# Altium project ECU.PrjPcb
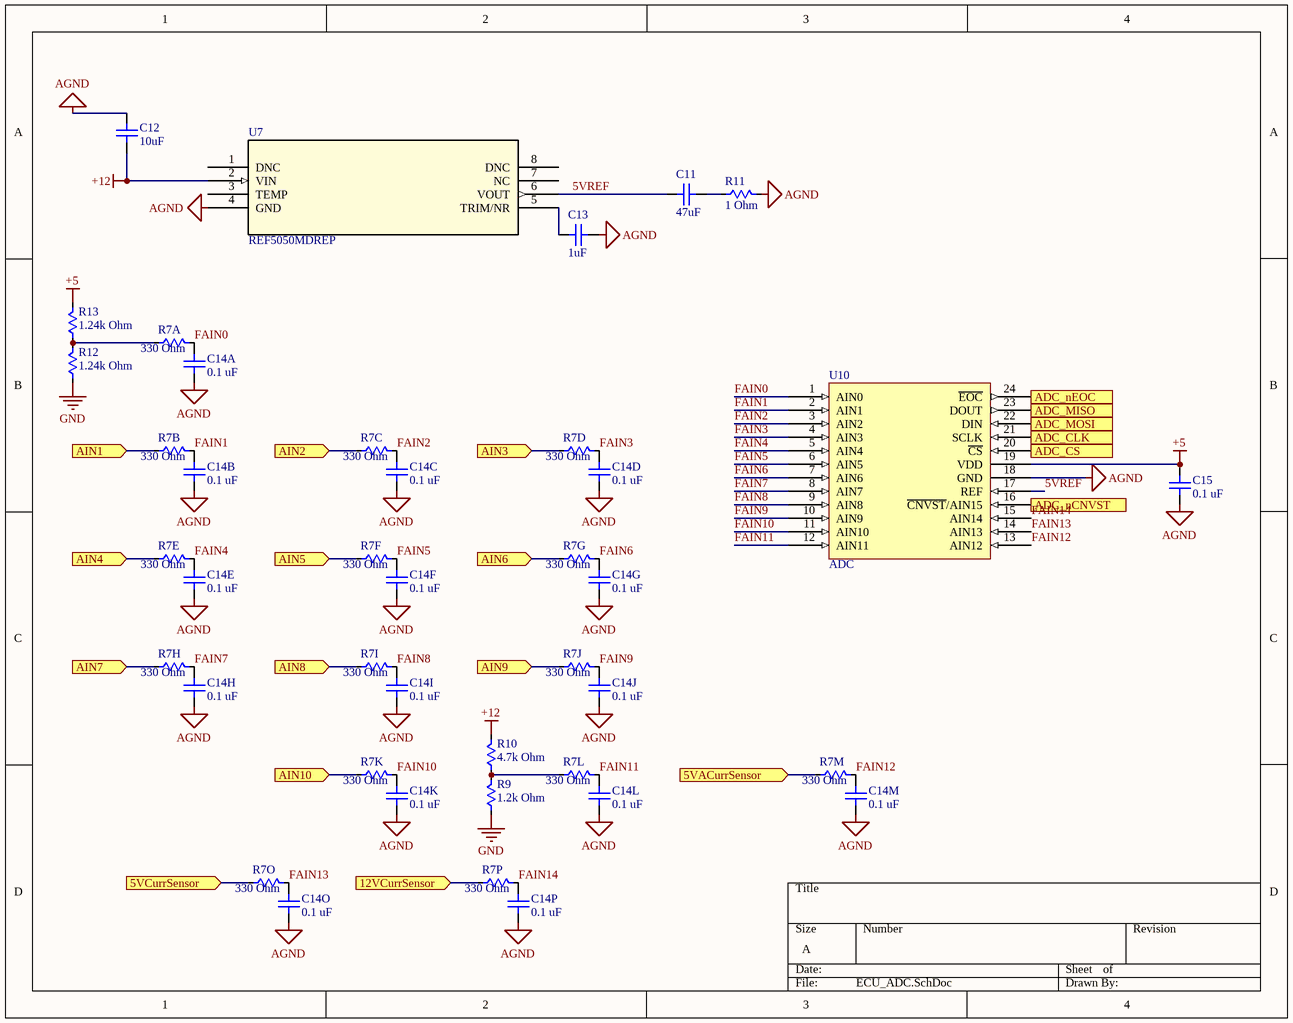
[diagram p0: ECU_ADC.SchDoc]
3 sheets, 79 parts. Net scope: flat (ports and power ports of the same name join across sheets).
Board file: ECU.PcbDoc
Sheets:
  ECU_ADC.SchDoc
  ECU_Interface.SchDoc
  ECU_Power.SchDoc

## Sheet ECU_ADC.SchDoc
size A; SheetNumber: 1; SheetTotal: 3

### Parts
C11  47uF  [0805]
C12  10uF  [0805]
C13  1uF  [0805]
C14A  0.1 uF  [0805]
C14B  0.1 uF  [0805]
C14C  0.1 uF  [0805]
C14D  0.1 uF  [0805]
C14E  0.1 uF  [0805]
C14F  0.1 uF  [0805]
C14G  0.1 uF  [0805]
C14H  0.1 uF  [0805]
C14I  0.1 uF  [0805]
C14J  0.1 uF  [0805]
C14K  0.1 uF  [0805]
C14L  0.1 uF  [0805]
C14M  0.1 uF  [0805]
C14O  0.1 uF  [0805]
C14P  0.1 uF  [0805]
C15  0.1 uF  [0805]
R7A  330 Ohm  [0805]
R7B  330 Ohm  [0805]
R7C  330 Ohm  [0805]
R7D  330 Ohm  [0805]
R7E  330 Ohm  [0805]
R7F  330 Ohm  [0805]
R7G  330 Ohm  [0805]
R7H  330 Ohm  [0805]
R7I  330 Ohm  [0805]
R7J  330 Ohm  [0805]
R7K  330 Ohm  [0805]
R7L  330 Ohm  [0805]
R7M  330 Ohm  [0805]
R7O  330 Ohm  [0805]
R7P  330 Ohm  [0805]
R9  1.2k Ohm  [0805]
R10  4.7k Ohm  [0805]
R11  1 Ohm  [0805]
R12  1.24k Ohm  [0805]
R13  1.24k Ohm  [0805]
U7  REF5050MDREP  [D8]
U10  ADC  [QSOP24]

### Ports
5VACurrSensor (in), 5VCurrSensor (in), 12VCurrSensor (in), ADC_CLK (in), ADC_CS (in), ADC_MISO (out), ADC_MOSI (in), ADC_nCNVST (in), ADC_nEOC (out), AIN1 (in), AIN2 (in), AIN3 (in), AIN4 (in), AIN5 (in), AIN6 (in), AIN7 (in), AIN8 (in), AIN9 (in), AIN10 (in)

### Nets
+5: C15.2 R13.2 U10.19(VDD)
+12: C12.2 R10.2 U7.2(VIN)
AGND: C12.1 C13.2 C14A.1 C14B.1 C14C.1 C14D.1 C14E.1 C14F.1 C14G.1 C14H.1 C14I.1 C14J.1 C14K.1 C14L.1 C14M.1 C14O.1 C14P.1 C15.1 R11.2 U7.4(GND) U10.18(GND)
GND: R9.1 R12.1
5VREF: C11.1 U7.6(VOUT) U10.17(REF)
12VCurrSensor: R7P.1 ; port 12VCurrSensor
FAIN0: C14A.2 R7A.2 U10.1(AIN0)
FAIN1: C14B.2 R7B.2 U10.2(AIN1)
FAIN2: C14C.2 R7C.2 U10.3(AIN2)
FAIN3: C14D.2 R7D.2 U10.4(AIN3)
FAIN4: C14E.2 R7E.2 U10.5(AIN4)
FAIN5: C14F.2 R7F.2 U10.6(AIN5)
FAIN6: C14G.2 R7G.2 U10.7(AIN6)
FAIN7: C14H.2 R7H.2 U10.8(AIN7)
FAIN8: C14I.2 R7I.2 U10.9(AIN8)
FAIN9: C14J.2 R7J.2 U10.10(AIN9)
FAIN10: C14K.2 R7K.2 U10.11(AIN10)
FAIN11: C14L.2 R7L.2 U10.12(AIN11)
FAIN12: C14M.2 R7M.2 U10.13(AIN12)
FAIN13: C14O.2 R7O.2 U10.14(AIN13)
FAIN14: C14P.2 R7P.2 U10.15(AIN14)
NetC11_2: C11.2 R11.1
NetC13_1: C13.1 U7.5(TRIM/NR)
NetJ1_1: R7K.1 ; port AIN10
NetJ1_2: R7B.1 ; port AIN1
NetJ1_3: R7C.1 ; port AIN2
NetJ1_4: R7D.1 ; port AIN3
NetJ1_5: R7E.1 ; port AIN4
NetJ1_6: R7F.1 ; port AIN5
NetJ1_7: R7G.1 ; port AIN6
NetJ1_8: R7H.1 ; port AIN7
NetJ1_9: R7I.1 ; port AIN8
NetJ1_10: R7J.1 ; port AIN9
NetJ4_0-ADC_SS: U10.20(~{CS}) ; port ADC_CS
NetJ4_1-ADC_MISO: U10.23(DOUT) ; port ADC_MISO
NetJ4_15: U10.16(~{CNVST}/AIN15) ; port ADC_nCNVST
NetJ4_16: U10.24(~{EOC}) ; port ADC_nEOC
NetJ4_26-ADC_MOSI: U10.22(DIN) ; port ADC_MOSI
NetJ4_27-ADC_CLK: U10.21(SCLK) ; port ADC_CLK
NetR7A_1: R7A.1 R12.2 R13.1
NetR7L_1: R7L.1 R9.2 R10.1
NetR7M_1: R7M.1 ; port 5VACurrSensor
NetR7O_1: R7O.1 ; port 5VCurrSensor

Not connected (* = marked no-connect by the designer): U7 1(DNC) 3(TEMP) 7(NC) 8(DNC)

### Library data of the parts
C11 = Cap_0805: Samsung Microelectronics CL21A476MQYNNNE
C12 C14A C14B C14C C14D C14E C14F C14G C14H C14I C14J C14K C14L C14M C14O C14P C15 = Cap_0805: Cap 0805
C13 = Cap_0805: 1uF Cap
R7A R7B R7C R7D R7E R7F R7G R7H R7I R7J R7K R7L R7M R7O R7P R9-R13 = Res_0805: Res 0805
U7 = REF5050MDREP: No Description Available; Mfr_Name: Texas Instruments; Copyright: Copyright (C) 2022 Ultra Librarian. All rights reserved.; Manufacturer_Part_Number: REF5050MDREP; RefDes: RefDes; Type: DEV
U10 = MAX11624EEG+-ND: GLOVE, POLYAMIDE, L/FREE, PU, SIZE 6 - More Details

## Sheet ECU_Interface.SchDoc
size A; SheetNumber: 2; SheetTotal: 3
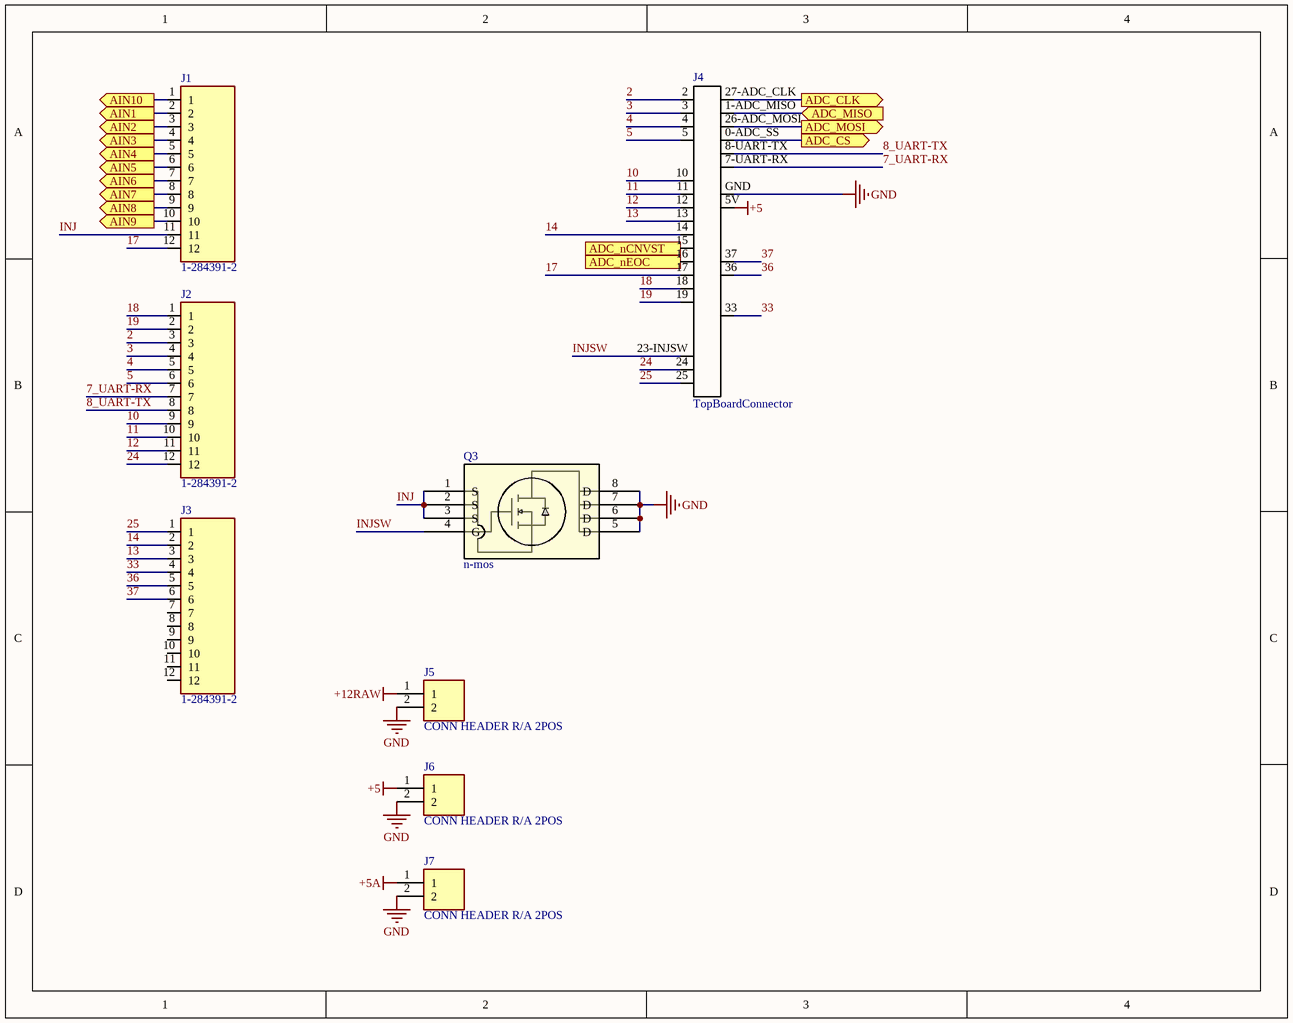
[diagram p1: ECU_Interface.SchDoc]

### Parts
J1  1-284391-2  [TE_1-284391-2]
J2  1-284391-2  [TE_1-284391-2]
J3  1-284391-2  [TE_1-284391-2]
J4  TopBoardConnector  [TopBoardConnector]
J5  CONN HEADER R/A 2POS  [2 POS MOLEX]
J6  CONN HEADER R/A 2POS  [2 POS MOLEX]
J7  CONN HEADER R/A 2POS  [2 POS MOLEX]
Q3  n-mos  [D0008A-IPC_A]

### Ports
ADC_CLK (out), ADC_CS (out), ADC_MISO (in), ADC_MOSI (out), ADC_nCNVST (out), ADC_nEOC (in), AIN1 (out), AIN2 (out), AIN3 (out), AIN4 (out), AIN5 (out), AIN6 (out), AIN7 (out), AIN8 (out), AIN9 (out), AIN10 (out)

### Nets
+5: J4.5V J6.1
+5A: J7.1
+12RAW: J5.1
GND: J4.GND J5.2 J6.2 J7.2 Q3.5(D) Q3.6(D) Q3.7(D) Q3.8(D)
2: J2.3 J4.2
3: J2.4 J4.3
4: J2.5 J4.4
5: J2.6 J4.5
7_UART-RX: J2.7 J4.7-UART-RX(8-UART-RX)
8_UART-TX: J2.8 J4.8-UART-TX
10: J2.9 J4.10
11: J2.10 J4.11
12: J2.11 J4.12
13: J3.3 J4.13
14: J3.2 J4.14
17: J1.12 J4.17
18: J2.1 J4.18
19: J2.2 J4.19
24: J2.12 J4.24
25: J3.1 J4.25
33: J3.4 J4.33
36: J3.5 J4.36
37: J3.6 J4.37
INJ: J1.11 Q3.1(S) Q3.2(S) Q3.3(S)
INJSW: J4.23-INJSW Q3.4(G)
NetJ1_1: J1.1 ; port AIN10
NetJ1_2: J1.2 ; port AIN1
NetJ1_3: J1.3 ; port AIN2
NetJ1_4: J1.4 ; port AIN3
NetJ1_5: J1.5 ; port AIN4
NetJ1_6: J1.6 ; port AIN5
NetJ1_7: J1.7 ; port AIN6
NetJ1_8: J1.8 ; port AIN7
NetJ1_9: J1.9 ; port AIN8
NetJ1_10: J1.10 ; port AIN9
NetJ4_0-ADC_SS: J4.0-ADC_SS ; port ADC_CS
NetJ4_1-ADC_MISO: J4.1-ADC_MISO ; port ADC_MISO
NetJ4_15: J4.15 ; port ADC_nCNVST
NetJ4_16: J4.16 ; port ADC_nEOC
NetJ4_26-ADC_MOSI: J4.26-ADC_MOSI ; port ADC_MOSI
NetJ4_27-ADC_CLK: J4.27-ADC_CLK ; port ADC_CLK

Not connected (* = marked no-connect by the designer): J3 7 8 9 10 11 12

### Library data of the parts
J1-J3 = 1-284391-2: Conn Eurostyle Block F 12 POS 3.5mm Solder ST Thru-Hole 12A/Contact Box; MF: TE Connectivity; DigiKey-Purchase-URL: https://snapeda.com/shop?store=DigiKey&id=2875340; Arrow_Electronics-Purchase-URL: https://snapeda.com/shop?store=Arrow+Electronics&id=2875340; Price: None; Availability: Good; Value: *; MP: 1-284391-2; Package: None; Mouser-Purchase-URL: https://snapeda.com/shop?store=Mouser&id=2875340; SnapEDA_Link: https://www.snapeda.com/parts/1-284391-2/TE%20Connectivity%20AMP%20Connectors/view-part/2875340/?ref=snap
J4 = TopBoardConnector: Connection to the bottom board
J5-J7 = 1724480002: Manufacturer: Molex; Connector Type: Male Pin; Number of Circuits: 2; Row Spacing: 0.165inch; Glow Wire Compliant: Compliant; Supplier 1: Digi-Key; Manufacturer Part Number: 1724480002; RoHS: No; Category: Headers and Wire Housings; Stock 1: 6210; Pricing 1: 1=0.55000, 10=0.46000, 100=0.35780, 1000=0.28116, 5000=0.24708, 10000=0.23004 (USD); Mount: Through Hole; Number of Pins: 2; Contact Plating: Tin; Color: Black; Orientation: Right Angle; Packaging: Tray; Number of Positions: 2; Number of Rows: 2; Termination: Solder; Fastening Type: Ramp; ComponentLink1URL: https://www.molex.com/pdm_docs/sd/1724480002_sd.pdf?src-supplier=Digi-Key; ComponentLink1Description: https://www.molex.com/pdm_docs/sd/1724480002_sd.pdf?src-supplier=Digi-Key; Supplier Part Number 1: WM16206-ND
Q3 = DMN3007LSSQ-13: MOSFET MOSFETBVDSS: 25V-30V

## Sheet ECU_Power.SchDoc
size A; SheetNumber: 3; SheetTotal: 3
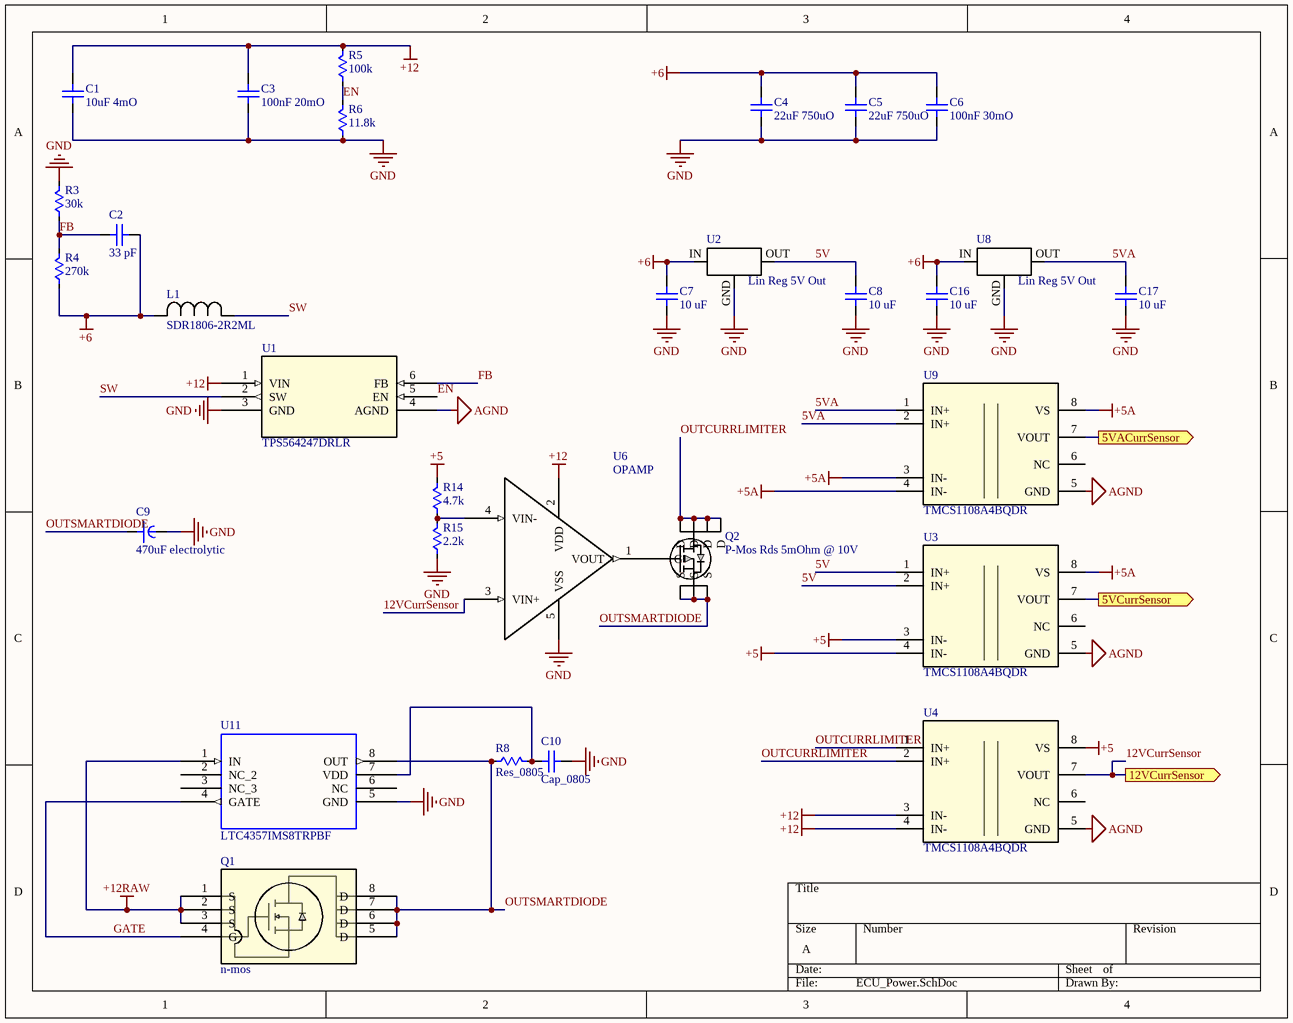
[diagram p2: ECU_Power.SchDoc]

### Parts
C1  10uF 4mO  [0805]
C2  33 pF  [0805]
C3  100nF 20mO  [0805]
C4  22uF 750uO  [0805]
C5  22uF 750uO  [0805]
C6  100nF 30mO  [0805]
C7  10 uF  [0805]
C8  10 uF  [0805]
C9  470uF electrolytic  [CAPPRD750W80D1600H2700]
C10  Cap_0805  [0805]
C16  10 uF  [0805]
C17  10 uF  [0805]
L1  SDR1806-2R2ML  [IND_BOURNS_SDR1806]
Q1  n-mos  [D0008A-IPC_A]
Q2  P-Mos Rds 5mOhm @ 10V  [D0008A-IPC_A]
R3  30k  [0805]
R4  270k  [0805]
R5  100k  [0805]
R6  11.8k  [0805]
R8  Res_0805  [0805]
R14  4.7k  [0805]
R15  2.2k  [0805]
U1  TPS564247DRLR  [SOT5x3-6_DRL_TEX]
U2  Lin Reg 5V Out  [NCP1117IDT50T4G]
U3  TMCS1108A4BQDR  [D0008A-IPC_A]
U4  TMCS1108A4BQDR  [D0008A-IPC_A]
U6  OPAMP  [SOT-23-5_MC_MCH-M]
U8  Lin Reg 5V Out  [NCP1117IDT50T4G]
U9  TMCS1108A4BQDR  [D0008A-IPC_A]
U11  LTC4357IMS8TRPBF  [MSOP-8_MS]

### Ports
5VACurrSensor (out), 5VCurrSensor (out), 12VCurrSensor (out)

### Nets
+5: R14.2 U3.3(IN-) U3.4(IN-) U4.8(VS)
+5A: U3.8(VS) U9.3(IN-) U9.4(IN-) U9.8(VS)
+6: C2.2 C4.2 C5.2 C6.2 C7.2 C16.2 L1.2 R4.1 U2.IN U8.IN
+12: C1.2 C3.2 R5.2 U1.1(VIN) U4.3(IN-) U4.4(IN-) U6.2(VDD)
+12RAW: Q1.1(S) Q1.2(S) Q1.3(S) U11.1(IN)
AGND: U1.4(AGND) U3.5(GND) U4.5(GND) U9.5(GND)
GND: C1.1 C3.1 C4.1 C5.1 C6.1 C7.1 C8.1 C9.2 C10.2 C16.1 C17.1 R3.2 R6.1 R15.1 U1.3(GND) U2.GND U6.5(VSS) U8.GND U11.5(GND)
5V: C8.2 U2.OUT U3.1(IN+) U3.2(IN+)
5VA: C17.2 U8.OUT U9.1(IN+) U9.2(IN+)
12VCurrSensor: U4.7(VOUT) U6.3(VIN+) ; port 12VCurrSensor
EN: R5.1 R6.2 U1.5(EN)
FB: C2.1 R3.1 R4.2 U1.6(FB)
GATE: Q1.4(G) U11.4(GATE)
OUTCURRLIMITER: Q2.5(D) Q2.6(D) Q2.7(D) Q2.8(D) U4.1(IN+) U4.2(IN+)
OUTSMARTDIODE: C9.1 Q1.5(D) Q1.6(D) Q1.7(D) Q1.8(D) Q2.1(S) Q2.2(S) Q2.3(S) R8.1 U11.8(OUT)
SW: L1.1 U1.2(SW)
NetC10_1: C10.1 R8.2 U11.7(VDD)
NetQ2_4: Q2.4(G) U6.1(VOUT)
NetR7M_1: U9.7(VOUT) ; port 5VACurrSensor
NetR7O_1: U3.7(VOUT) ; port 5VCurrSensor
NetR14_1: R14.1 R15.2 U6.4(VIN-)

Not connected (* = marked no-connect by the designer): U3 6(NC); U4 6(NC); U9 6(NC); U11 2(NC_2) 3(NC_3) 6(NC)

### Library data of the parts
C1 C3-C8 C10 C16 C17 = Cap_0805: Cap 0805
C2 = Cap_0805: Cap 0805 - 33 pF, 1mOhm
C9 = CAPPRD750W80D1600H2700: 470 µF 100 V Aluminum Electrolytic Capacitors Radial, Can 282mOhm @ 120Hz 2000 Hrs @ 85°C
L1 = SDR1806-2R2ML: No Description Available; Mfr_Name: Bourns Electronics; Type: DEV; Copyright: Copyright (C) 2022 Ultra Librarian. All rights reserved.; Manufacturer_Part_Number: SDR1806-2R2ML; RefDes: RefDes
Q1 = DMN3007LSSQ-13: MOSFET MOSFETBVDSS: 25V-30V
Q2 = UPA2735GR-E1-AT: P-Channel 30 V 16A (Ta) 2.5W (Ta) Surface Mount 8-SOP; Mfr_Name: Renesas Electronics; Type: DEV; Copyright: Copyright (C) 2022 Ultra Librarian. All rights reserved.; Manufacturer_Part_Number: UPA2735GR-E1-AT; RefDes: RefDes
R3 = Res_0805: Res 0805 - 30kOhm
R4 = Res_0805: Res 0805 - 270kOhm
R5 R6 R8 R14 R15 = Res_0805: Res 0805
U1 = TPS564247DRLR: No Description Available; Mfr_Name: Texas Instruments; Copyright: Copyright (C) 2022 Ultra Librarian. All rights reserved.; Manufacturer_Part_Number: TPS564247DRLR; RefDes: RefDes; Type: DEV
U2 U8 = NCP1117IDT50T4G: Linear Voltage Regulator IC Positive Fixed 1 Output 1A DPAK
U3 U4 U9 = TMCS1108A4BQDR: No Description Available; Mfr_Name: Texas Instruments; Type: DEV; RefDes: RefDes; Copyright: Copyright (C) 2022 Ultra Librarian. All rights reserved.; Manufacturer_Part_Number: TMCS1108A4BQDR
U6 = MCP6486T-EOT: Operational Amplifiers - Op Amps Single, 10MHz Op Amp, E Temp; Mfr_Name: Microchip; Copyright: Copyright (C) 2022 Ultra Librarian. All rights reserved.; Manufacturer_Part_Number: MCP6486T-EOT; RefDes: RefDes; Type: DEV
U11 = LTC4357IMS8TRPBF: OR Controller N+1 ORing Controller N-Channel N:1 8-MSOP; MF: Analog Devices; MP: LTC4357IMS8#TRPBF; Value: *; Package: MSOP-8 Analog Devices; Price: None; Availability: Unavailable; SnapEDA_Link: https://www.snapeda.com/parts/LTC4357IMS8%23TRPBF/Analog%20Devices/view-part/4335178/?ref=snap

## Nets that join several sheets
+5: ECU_ADC (C15.2 R13.2 U10.19), ECU_Interface (J4.5V J6.1), ECU_Power (R14.2 U3.3 U3.4 U4.8)
+5A: ECU_Interface (J7.1), ECU_Power (U3.8 U9.3 U9.4 U9.8)
+12: ECU_ADC (C12.2 R10.2 U7.2), ECU_Power (7 pins)
+12RAW: ECU_Interface (J5.1), ECU_Power (Q1.1 Q1.2 Q1.3 U11.1)
AGND: ECU_ADC (21 pins), ECU_Power (U1.4 U3.5 U4.5 U9.5)
GND: ECU_ADC (R9.1 R12.1), ECU_Interface (8 pins), ECU_Power (19 pins)
12VCurrSensor: ECU_ADC (R7P.1), ECU_Power (U4.7 U6.3)
NetJ1_1: ECU_ADC (R7K.1), ECU_Interface (J1.1)
NetJ1_2: ECU_ADC (R7B.1), ECU_Interface (J1.2)
NetJ1_3: ECU_ADC (R7C.1), ECU_Interface (J1.3)
NetJ1_4: ECU_ADC (R7D.1), ECU_Interface (J1.4)
NetJ1_5: ECU_ADC (R7E.1), ECU_Interface (J1.5)
NetJ1_6: ECU_ADC (R7F.1), ECU_Interface (J1.6)
NetJ1_7: ECU_ADC (R7G.1), ECU_Interface (J1.7)
NetJ1_8: ECU_ADC (R7H.1), ECU_Interface (J1.8)
NetJ1_9: ECU_ADC (R7I.1), ECU_Interface (J1.9)
NetJ1_10: ECU_ADC (R7J.1), ECU_Interface (J1.10)
NetJ4_0-ADC_SS: ECU_ADC (U10.20), ECU_Interface (J4.0-ADC_SS)
NetJ4_1-ADC_MISO: ECU_ADC (U10.23), ECU_Interface (J4.1-ADC_MISO)
NetJ4_15: ECU_ADC (U10.16), ECU_Interface (J4.15)
NetJ4_16: ECU_ADC (U10.24), ECU_Interface (J4.16)
NetJ4_26-ADC_MOSI: ECU_ADC (U10.22), ECU_Interface (J4.26-ADC_MOSI)
NetJ4_27-ADC_CLK: ECU_ADC (U10.21), ECU_Interface (J4.27-ADC_CLK)
NetR7M_1: ECU_ADC (R7M.1), ECU_Power (U9.7)
NetR7O_1: ECU_ADC (R7O.1), ECU_Power (U3.7)